# EAGLE design PKD (EAGLE 6.1)
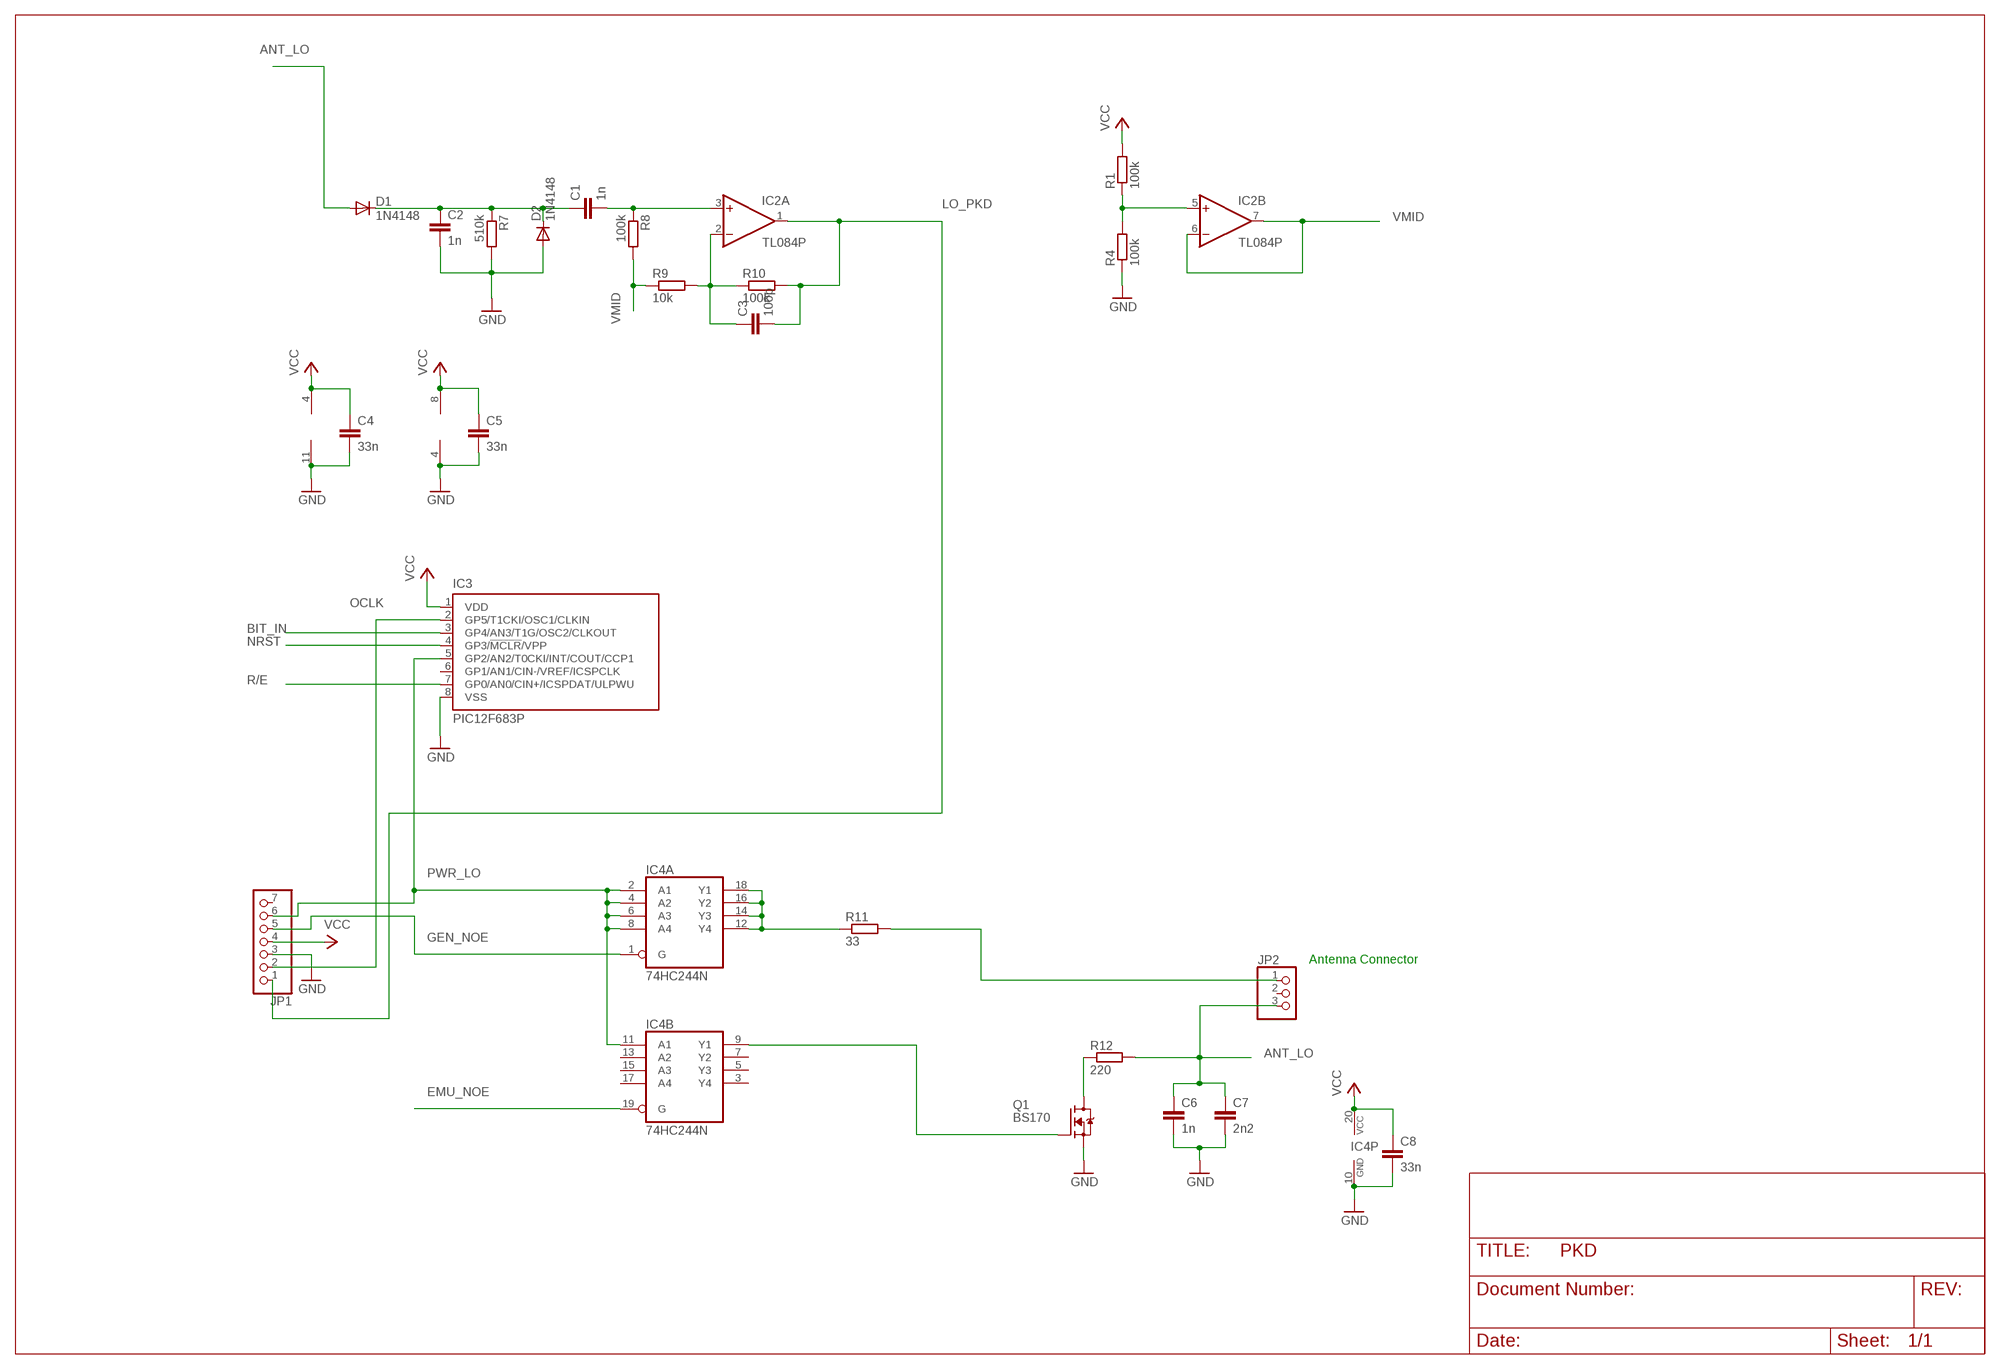
[diagram p0: schematic, sheet 1]

## Parts
C1  1n  C-EU025-025X050  [C025-025X050]
C2  1n  C-EU050-030X075  [C050-030X075]
C3  100p  C-EU025-025X050  [C025-025X050]
C4  33n  C-EU025-025X050  [C025-025X050]
C5  33n  C-EU025-025X050  [C025-025X050]
C6  1n  C-EU025-025X050  [C025-025X050]
C7  2n2  C-EU025-025X050  [C025-025X050]
C8  33n  C-EU050-030X075  [C050-030X075]
D1  1N4148  1N4148DO35-10  [DO35-10]
D2  1N4148  1N4148DO35-10  [DO35-10]
IC1  LM393N  [DIL08]
IC2  TL084P  [DIL14]
IC3  PIC12F683P  [DIL8]
IC4  74HC244N  [DIL20]
JP1  PINHD-1X7  [1X07]
JP2  PINHD-1X3/90  [1X03/90]
Q1  BS170  [TO92-]
R1  100k  R-EU_0207/10  [0207/10]
R4  100k  R-EU_0207/10  [0207/10]
R7  510k  R-EU_0207/10  [0207/10]
R8  100k  R-EU_0207/10  [0207/10]
R9  10k  R-EU_0207/10  [0207/10]
R10  100k  R-EU_0207/10  [0207/10]
R11  33  R-EU_0207/10  [0207/10]
R12  220  R-EU_0207/10  [0207/10]

## Nets
ANT_LO: C6.1 C7.1 D1.A JP2.3 R12.2
BIT_IN: IC3.3(GP4/AN3/T1G/OSC2/CLKOUT)
EMU_NOE: IC4.19(B:G)
GEN_NOE: IC4.1(A:G) JP1.5
GND: C2.2 C4.2 C5.2 C6.2 C7.2 C8.2 D2.A IC1.4(P:V-) IC2.11(P:V-) IC3.8(VSS) IC4.10(P:GND) JP1.3 Q1.3(S) R4.1 R7.2
LO_PKD: C3.2 IC2.1(A:OUT) JP1.1 R10.2
N$1: C1.1 C2.1 D1.C D2.C R7.1
N$2: C1.2 IC2.3(A:+IN) R8.1
N$3: IC2.5(B:+IN) R1.1 R4.2
N$4: Q1.1(D) R12.1
N$5: C3.1 IC2.2(A:-IN) R9.2 R10.1
N$7: IC4.9(B:Y1) Q1.2(G)
N$13: JP2.1 R11.2
N$14: IC4.12(A:Y4) IC4.14(A:Y3) IC4.16(A:Y2) IC4.18(A:Y1) R11.1
NRST: IC3.4(GP3/!MCLR!/VPP)
OCLK: IC3.2(GP5/T1CKI/OSC1/CLKIN) JP1.2
PWR_LO: IC3.5(GP2/AN2/T0CKI/INT/COUT/CCP1) IC4.2(A:A1) IC4.4(A:A2) IC4.6(A:A3) IC4.8(A:A4) IC4.11(B:A1) JP1.6
R/E: IC3.7(GP0/AN0/CIN+/ICSPDAT/ULPWU)
VCC: C4.1 C5.1 C8.1 IC1.8(P:V+) IC2.4(P:V+) IC3.1(VDD) IC4.20(P:VCC) JP1.4 R1.2
VMID: IC2.6(B:-IN) IC2.7(B:OUT) R8.2 R9.1
Unconnected: IC1.1(A:OUT) IC1.2(A:-IN) IC1.3(A:+IN) IC1.5(B:+IN) IC1.6(B:-IN) IC1.7(B:OUT) IC2.8(C:OUT) IC2.9(C:-IN) IC2.10(C:+IN) IC2.12(D:+IN) IC2.13(D:-IN) IC2.14(D:OUT) IC3.6(GP1/AN1/CIN-/VREF/ICSPCLK) IC4.3(B:Y4) IC4.5(B:Y3) IC4.7(B:Y2) IC4.13(B:A2) IC4.15(B:A3) IC4.17(B:A4) JP1.7 JP2.2

## Notes on the sheet
- Antenna Connector

## Library data of the parts
C1-C8 = rcl:C-EU: CAPACITOR, European symbol
D1 D2 = diode:1N4148: DIODE high speed (Philips)
IC1 = linear:LM393: COMPARATOR
IC2 = linear:TL084: OP AMP
IC3 = microchip:PIC12F683: 8-Pin Flash-Based, 8-Bit CMOS Microcontrollers with nanoWatt Technology Source: http://ww1.microchip.com/downloads/en/DeviceDoc/41211D_.pdf; MF: MICROCHIP; MPN: PIC12F683-I/P; OC_FARNELL: 9759034; OC_NEWARK: 89H0442
IC4 = 74xx-eu:74*244: Octal BUFFER and LINE DRIVER, 3-state
JP1 = pinhead:PINHD-1X7: PIN HEADER
JP2 = pinhead:PINHD-1X3: PIN HEADER
Q1 = adam:BS170
R1 R4 R7-R12 = rcl:R-EU_: RESISTOR, European symbol

## Board
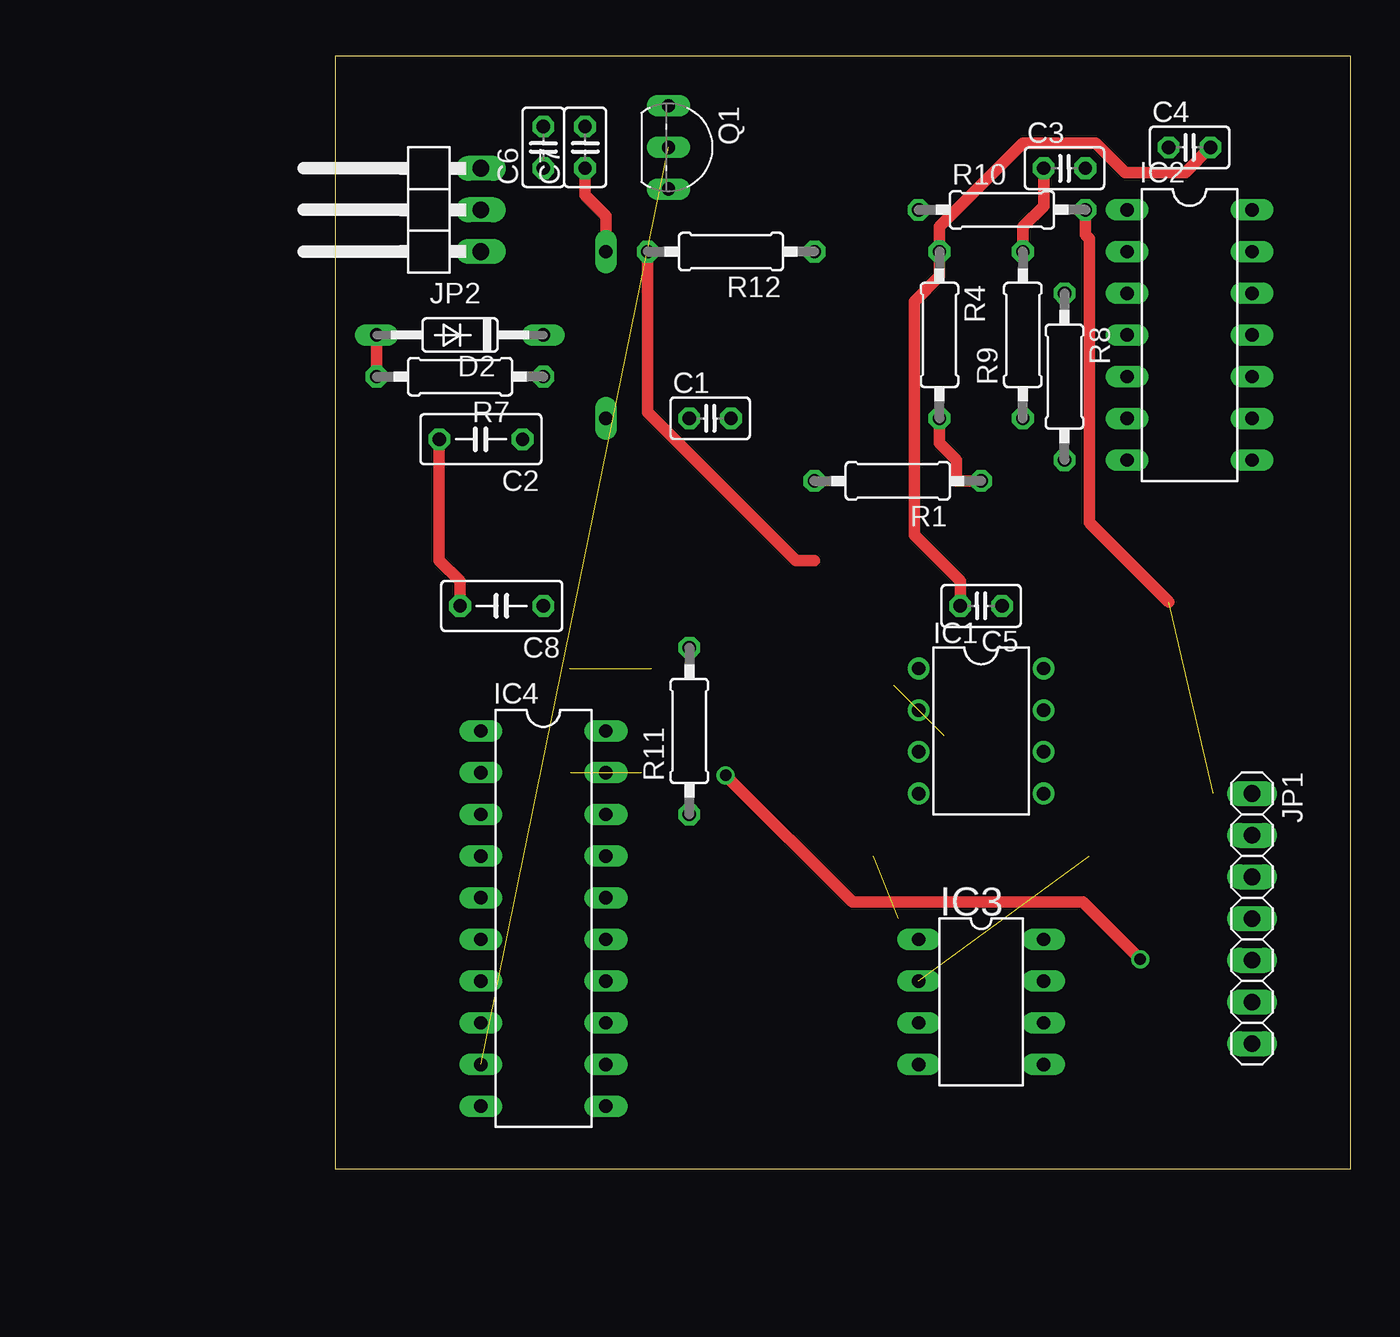
[diagram p1: board, top side]
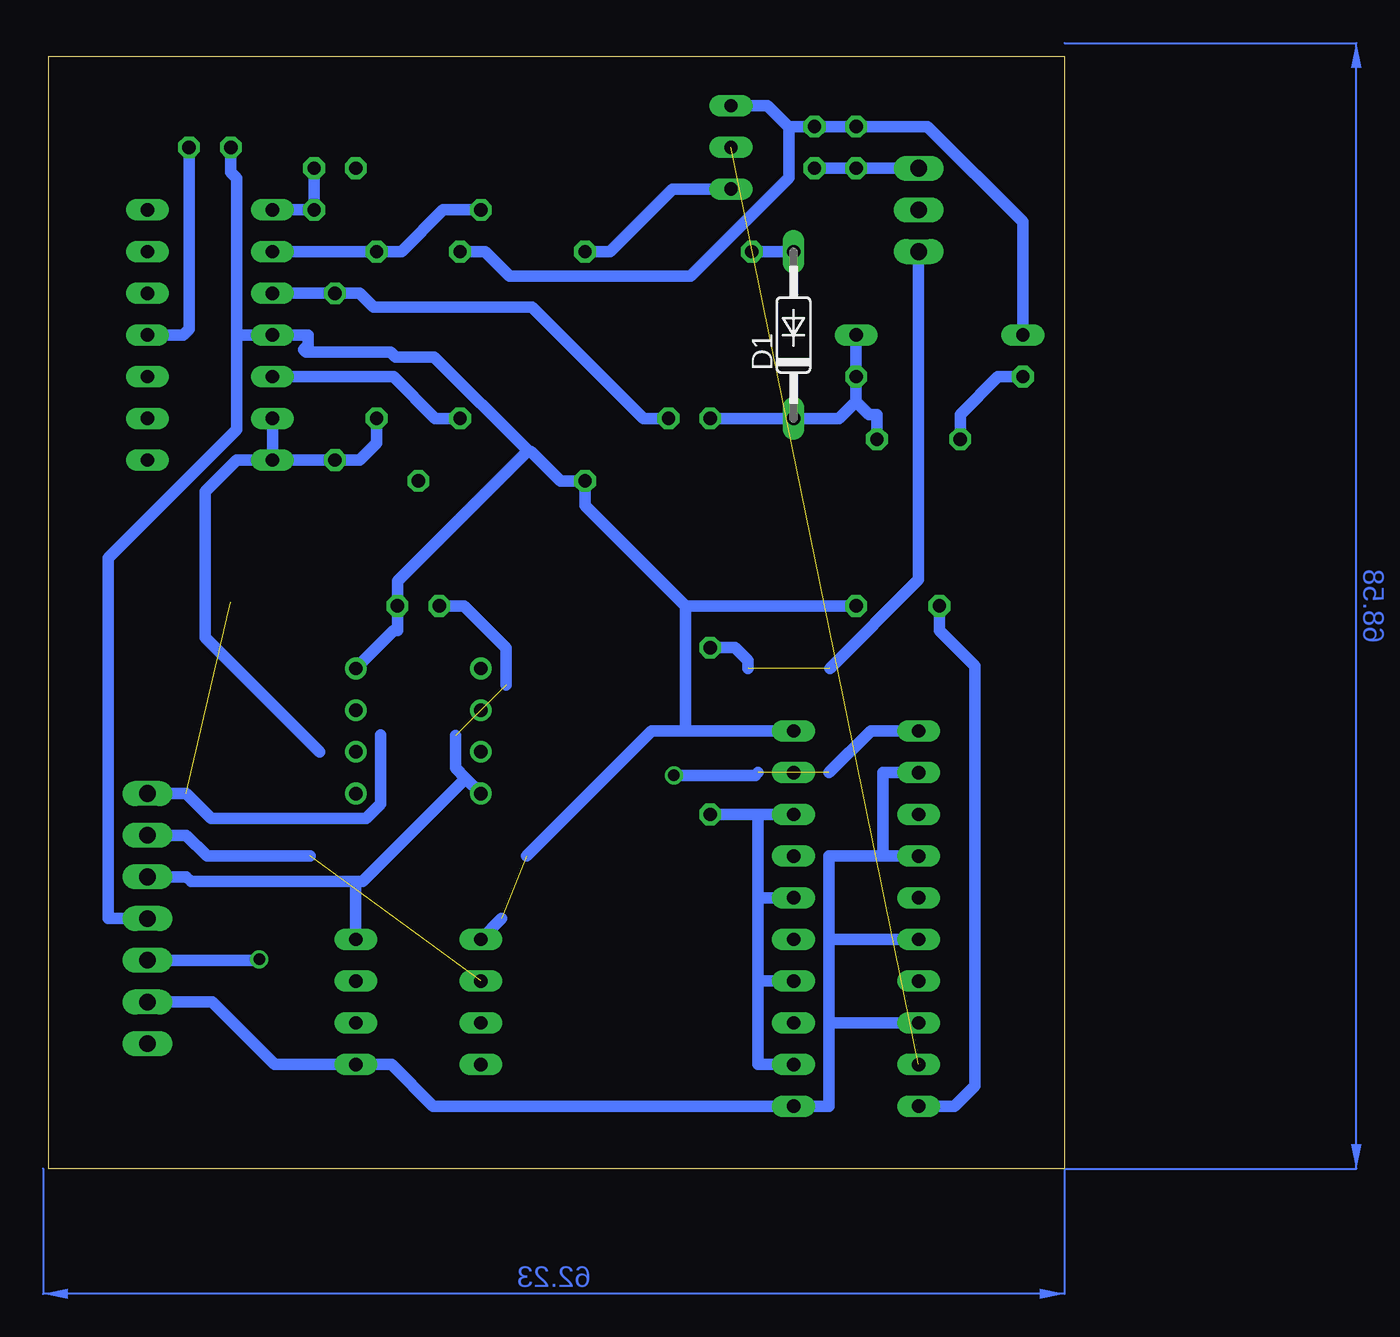
[diagram p2: board, bottom side, seen from below]

Size 61.9 x 67.78 mm. Coordinates in mm from the lower left corner, seen from the top.
Outline: 0,0 61.9,0 61.9,67.78 0,67.78 0,0
Copper layers (1*16): Top 0.035mm / dielectric 1.5mm / Bottom 0.035mm
Design rules: minimum track width 0.7mm, minimum drill 0.7mm, track to track 0.5mm, track to pad 0.5mm, pad to pad 0.5mm, via to via 0.5mm, smd to smd 8mil, copper to edge 40mil, drill to drill 8mil, minimum pad ring 10mil, minimum via ring 8mil, stop-mask expansion 4mil, vias tented up to drill 0mil, thermal gap 10mil
tRestrict: area 7.6,2.5 to 17.8,27.9; area 34.3,5.1 to 44.5,15.2; area 34.3,20.3 to 44.5,33; area 53.3,5.1 to 58.4,25.4; area 47,41.9 to 57.1,59.7; area 2.5,54.6 to 10.2,62.2; area 19,58.4 to 22.9,66

### Footprints (pad centres in the part's own frame; a part is rotated, then mirrored left to right if it is on the bottom)
C025-025X050 = drill 0.813 octagon: 1 -1.27,0; 2 1.27,0
C050-030X075 = drill 0.813 octagon: 1 -2.54,0; 2 2.54,0
DO35-10 = drill 0.813 long: A 5.08,0; C -5.08,0
DIL08 = drill 0.813 pad 1.27: 1 -3.81,-3.81; 2 -1.27,-3.81; 3 1.27,-3.81; 4 3.81,-3.81; 5 3.81,3.81; 6 1.27,3.81; 7 -1.27,3.81; 8 -3.81,3.81
DIL14 = drill 0.813 long: 1 -7.62,-3.81; 2 -5.08,-3.81; 3 -2.54,-3.81; 4 0,-3.81; 5 2.54,-3.81; 6 5.08,-3.81; 7 7.62,-3.81; 8 7.62,3.81; 9 5.08,3.81; 10 2.54,3.81; 11 0,3.81; 12 -2.54,3.81; 13 -5.08,3.81; 14 -7.62,3.81
DIL8 = drill 0.813 long: 1 -3.81,-3.81; 2 -1.27,-3.81; 3 1.27,-3.81; 4 3.81,-3.81; 5 3.81,3.81; 6 1.27,3.81; 7 -1.27,3.81; 8 -3.81,3.81
DIL20 = drill 0.813 long: 1 -11.43,-3.81; 2 -8.89,-3.81; 3 -6.35,-3.81; 4 -3.81,-3.81; 5 -1.27,-3.81; 6 1.27,-3.81; 7 3.81,-3.81; 8 6.35,-3.81; 9 8.89,-3.81; 10 11.43,-3.81; 11 11.43,3.81; 12 8.89,3.81; 13 6.35,3.81; 14 3.81,3.81; 15 1.27,3.81; 16 -1.27,3.81; 17 -3.81,3.81; 18 -6.35,3.81; 19 -8.89,3.81; 20 -11.43,3.81
1X07 = drill 1.016 long: 1 -7.62,0; 2 -5.08,0; 3 -2.54,0; 4 0,0; 5 2.54,0; 6 5.08,0; 7 7.62,0
1X03/90 = drill 1.016 long: 1 -2.54,-3.81; 2 0,-3.81; 3 2.54,-3.81
TO92- = drill 0.813 long: 1 2.54,0; 2 0,0; 3 -2.54,0
0207/10 = drill 0.813 octagon: 1 -5.08,0; 2 5.08,0

### Placement (x,y rotation side)
C1  22.86,45.72 0 top
C2  8.89,44.45 180 top
C3  44.45,60.96 0 top
C4  52.07,62.23 0 top
C5  39.37,34.29 180 top
C6  12.7,62.23 90 top
C7  15.24,62.23 90 top
C8  10.16,34.29 180 top
D1  16.51,50.8 90 bottom
D2  7.62,50.8 180 top
IC1  39.37,26.67 270 top
IC2  52.07,50.8 270 top
IC3  39.37,10.16 270 top
IC4  12.7,15.24 270 top
JP1  55.88,15.24 270 top
JP2  5.08,58.42 90 top
Q1  20.32,62.23 270 top
R1  34.29,41.91 180 top
R4  36.83,50.8 270 top
R7  7.62,48.26 180 top
R8  44.45,48.26 270 top
R9  41.91,50.8 90 top
R10  40.64,58.42 0 top
R11  21.59,26.67 90 top
R12  24.13,55.88 180 top

### Tracks (layer width: path | path; a pad name or v marks a point on that pad's centre or on a via)
ANT_LO
  Top 0.7: R12.2 19.05,46.1 28.08,37.07 29.21,37.07 | D1.A 16.51,58.05 15.24,59.32 C7.1
  Bottom 0.7: R12.2 D1.A | JP2.3 C6.1 C7.1
GEN_NOE  (via drill 0.7 pad 1.11)  (1 unrouted)
  Top 0.7: v49.06,12.76 45.58,16.24 31.52,16.24 v23.8,23.97
  Bottom 0.7: v23.8,23.97 18.84,23.97 18.68,24.13 | JP1.5 49.12,12.7 v49.06,12.76 | 14.34,24.13 11.8,26.67 IC4.1
GND  (1 unrouted)
  Top 0.7: C4.2 51.8,60.69 48.14,60.69 46.37,62.47 41.91,62.47 36.83,57.39 R4.1 36.83,55.12 36.83,54.37 35.29,52.83 35.29,38.61 38.1,35.8 C5.2 | C8.2 7.62,35.8 6.35,37.07 C2.2 | R7.2 D2.A
  Bottom 0.7: 36.48,23.78 42.77,17.49 43.18,17.49 | 43.18,17.49 53.22,17.49 53.51,17.78 JP1.3 | 43.18,17.49 IC3.8 | 36.48,23.78 IC1.4 | 37.11,26.39 37.11,24.41 36.48,23.78 | D2.A 2.54,57.69 8.35,63.5 C6.2 C7.2 16.75,63.5 16.78,63.47 | 16.78,63.47 18.09,64.77 Q1.3 | 16.78,63.47 16.78,60.38 22.8,54.37 33.81,54.37 35.32,55.88 R4.1 | 16.78,63.47 | IC2.11 53.71,50.8 53.34,51.17 C4.2 | C5.2 36.59,34.29 34.03,31.73 34.03,29.47 | IC4.10 6.72,3.81 5.47,5.06 5.47,30.63 7.62,32.78 C8.2 | C2.2 6.35,45.96 4.05,48.26 R7.2
LO_PKD  (1 unrouted)
  Top 0.7: R10.2 45.72,56.91 45.96,56.66 45.96,39.37 50.8,34.53
  Bottom 0.7: IC2.1 46.09,58.42 R10.2 45.72,59.45 C3.2 | 41.67,26.43 41.67,22.24 42.55,21.35 51.99,21.35 53.51,22.86 JP1.1
N$1
  Bottom 0.7: 12.7,46.75 13.73,45.72 D1.C C1.1 | C2.1 11.43,45.96 11.91,45.96 12.7,46.75 | 12.7,46.75 R7.1 D2.C
N$2
  Bottom 0.7: IC2.3 R8.1 42.94,53.34 42.11,52.51 32.43,52.51 25.64,45.72 C1.2
N$3
  Top 0.7: R1.1 37.86,41.91 37.86,43.18 36.83,44.21 R4.2
  Bottom 0.7: R4.2 38.34,45.72 40.88,48.26 IC2.5
N$4
  Bottom 0.7: R12.1 27.7,55.88 23.89,59.69 Q1.1
N$5
  Top 0.7: R9.2 41.91,57.39 43.18,58.66 C3.1
  Bottom 0.7: IC2.2 R9.2 40.4,55.88 37.86,58.42 R10.1
N$7  (1 unrouted)
N$13  (1 unrouted)
  Bottom 0.7: R11.2 20.08,31.75 19.29,30.96 19.29,30.48 | JP2.1 8.89,35.89 14.3,30.48
N$14
  Bottom 0.7: IC4.12 18.68,6.35 18.68,11.43 | 18.68,11.43 18.38,11.43 IC4.14 | 18.68,16.51 18.68,11.43 | 18.68,21.59 18.68,16.51 | 18.68,21.59 IC4.18 | R11.1 18.68,21.59 | IC4.16 18.68,16.51
OCLK  (1 unrouted)
  Bottom 0.7: JP1.2 53.51,20.32 52.24,19.05 45.96,19.05
PWR_LO
  Bottom 0.7: JP1.6 51.94,10.16 48.13,6.35 IC3.5 41.01,6.35 38.47,3.81 IC4.11 14.34,3.81 14.34,8.89 | 14.34,8.89 11.06,8.89 IC4.8 | 14.34,13.97 14.34,8.89 | 14.34,13.97 10.76,13.97 IC4.6 | 14.34,13.97 14.34,19.05 11.06,19.05 | IC4.2 11.06,24.13 11.06,19.05 | IC4.4 11.06,19.05
VCC  (1 unrouted)
  Bottom 0.7: 32.69,43.75 38.41,49.46 40.76,49.46 41.07,49.77 46.2,49.77 46.35,49.91 46.35,49.92 46.09,50.17 46.09,50.8 IC2.4 50.13,50.8 50.43,50.8 | 32.69,43.75 32.63,43.68 32.49,43.68 30.72,41.91 R1.2 29.21,40.4 23.1,34.29 | JP1.4 58.25,15.24 58.25,37.22 50.43,45.04 50.43,50.8 | C4.1 50.8,60.72 50.43,60.35 50.43,50.8 | 34.29,15.24 IC3.1 | 23.1,26.67 IC4.20 | 32.78,19.05 25.16,26.67 23.1,26.67 | 23.1,34.29 23.1,26.67 | 23.1,34.29 14.21,34.29 C8.1 | 32.69,43.75 40.64,35.8 C5.1 40.64,32.78 40.88,32.78 IC1.8
VMID
  Bottom 0.7: R9.1 41.91,44.21 42.94,43.18 R8.2 IC2.7 | IC2.7 50.43,43.18 52.36,41.25 52.36,32.38 45.38,25.4 | IC2.7 IC2.6
(copper drawn outside any net)
  shapes: Bottom area x2